# Altium schematic sheet MCU.SchDoc
size A4
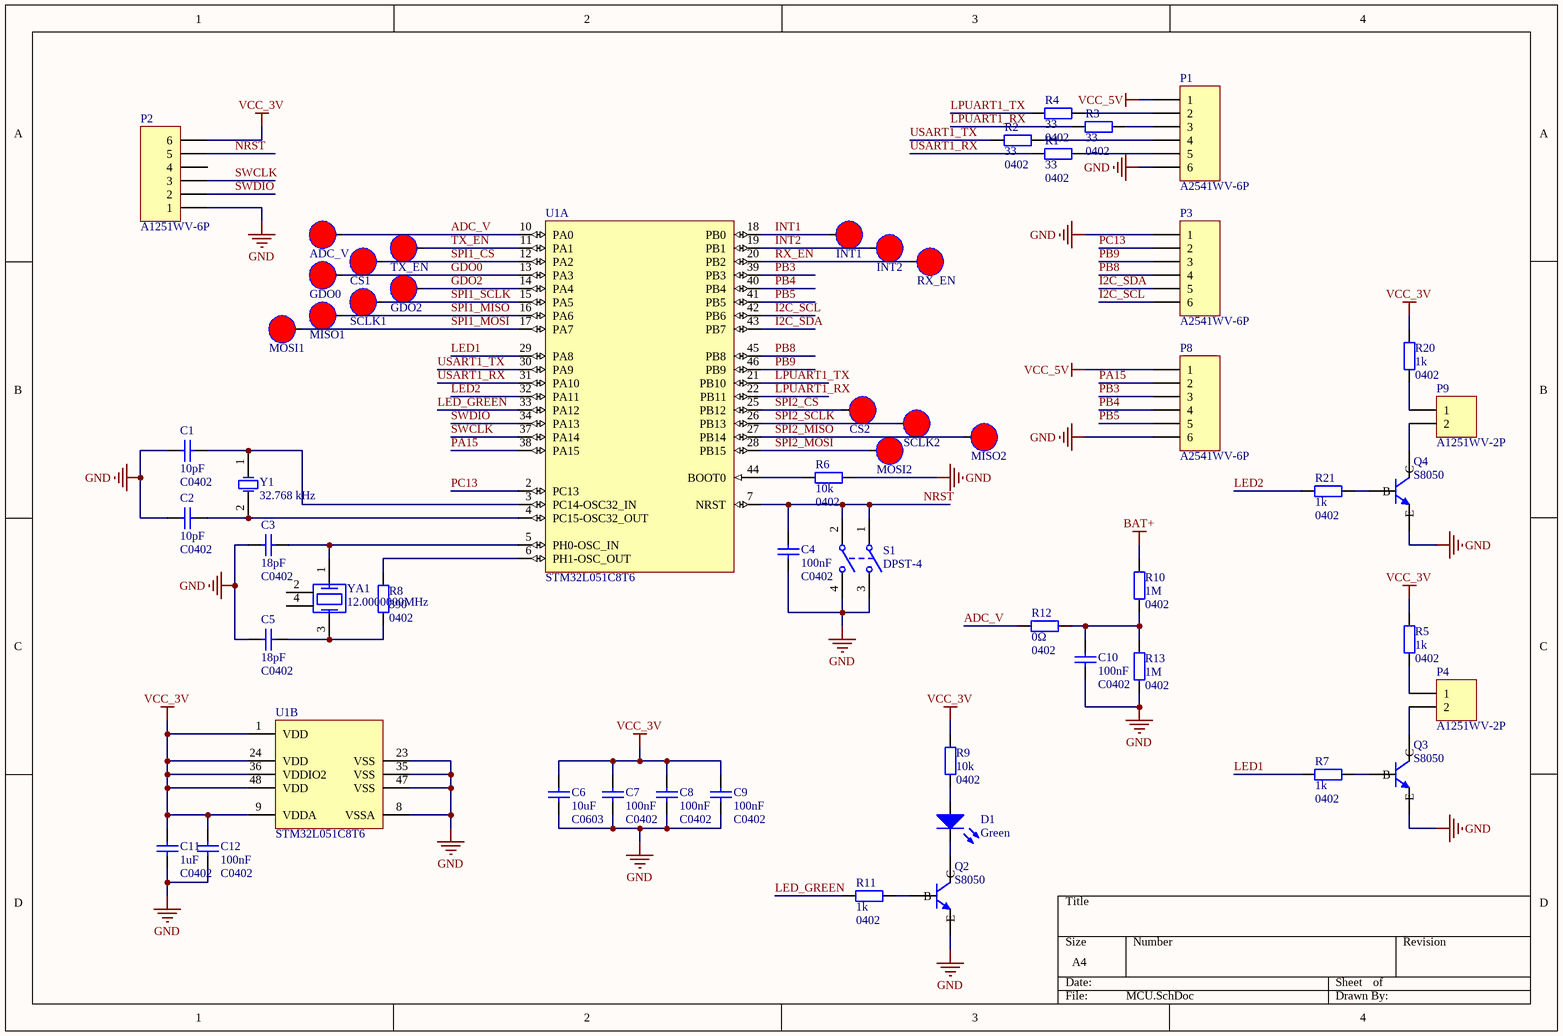
[diagram p0: MCU.SchDoc]

## Parts
ADC_V  TP-EMB-SMT-Single-20mil-1pin  [EMB-SMT-40MILX40MIL]  (value not drawn)
C1  10pF  PackageReference: C0402  [0402]
C2  10pF  PackageReference: C0402  [0402]
C3  18pF  PackageReference: C0402  [0402]
C4  100nF  PackageReference: C0402  [0402]
C5  18pF  PackageReference: C0402  [0402]
C6  10uF  PackageReference: C0603  [1608[0603]]
C7  100nF  PackageReference: C0402  [0402]
C8  100nF  PackageReference: C0402  [0402]
C9  100nF  PackageReference: C0402  [0402]
C10  100nF  PackageReference: C0402  [0402]
C11  1uF  PackageReference: C0402  [0402]
C12  100nF  PackageReference: C0402  [0402]
CS1  TP-EMB-SMT-Single-20mil-1pin  [EMB-SMT-40MILX40MIL]  (value not drawn)
CS2  TP-EMB-SMT-Single-20mil-1pin  [EMB-SMT-40MILX40MIL]  (value not drawn)
D1  Green  [0603/K]
GDO0  TP-EMB-SMT-Single-20mil-1pin  [EMB-SMT-40MILX40MIL]  (value not drawn)
GDO2  TP-EMB-SMT-Single-20mil-1pin  [EMB-SMT-40MILX40MIL]  (value not drawn)
INT1  TP-EMB-SMT-Single-20mil-1pin  [EMB-SMT-40MILX40MIL]  (value not drawn)
INT2  TP-EMB-SMT-Single-20mil-1pin  [EMB-SMT-40MILX40MIL]  (value not drawn)
MISO1  TP-EMB-SMT-Single-20mil-1pin  [EMB-SMT-40MILX40MIL]  (value not drawn)
MISO2  TP-EMB-SMT-Single-20mil-1pin  [EMB-SMT-40MILX40MIL]  (value not drawn)
MOSI1  TP-EMB-SMT-Single-20mil-1pin  [EMB-SMT-40MILX40MIL]  (value not drawn)
MOSI2  TP-EMB-SMT-Single-20mil-1pin  [EMB-SMT-40MILX40MIL]  (value not drawn)
P1  A2541WV-6P  [A2541WV-6P]
P2  A1251WV-6P  [A1251WV-6P-SWD]
P3  A2541WV-6P  [A2541WV-6P]
P4  A1251WV-2P  [A1251WV-2P]
P8  A2541WV-6P  [A2541WV-6P]
P9  A1251WV-2P  [A1251WV-2P]
Q2  S8050  [SOT-23B_N]
Q3  S8050  [SOT-23B_N]
Q4  S8050  [SOT-23B_N]
R1  33  PackageReference: 0402  [RESC1005X04N]
R2  33  PackageReference: 0402  [RESC1005X04N]
R3  33  PackageReference: 0402  [RESC1005X04N]
R4  33  PackageReference: 0402  [RESC1005X04N]
R5  1k  PackageReference: 0402  [RESC1005X04N]
R6  10k  PackageReference: 0402  [RESC1005X04N]
R7  1k  PackageReference: 0402  [RESC1005X04N]
R8  390  PackageReference: 0402  [RESC1005X04N]
R9  10k  PackageReference: 0402  [RESC1005X04N]
R10  1M  PackageReference: 0402  [RESC1005X04N]
R11  1k  PackageReference: 0402  [RESC1005X04N]
R12  0Ω  PackageReference: 0402  [RESC1005X04N]
R13  1M  PackageReference: 0402  [RESC1005X04N]
R20  1k  PackageReference: 0402  [RESC1005X04N]
R21  1k  PackageReference: 0402  [RESC1005X04N]
RX_EN  TP-EMB-SMT-Single-20mil-1pin  [EMB-SMT-40MILX40MIL]  (value not drawn)
S1  DPST-4  [DPST]
SCLK1  TP-EMB-SMT-Single-20mil-1pin  [EMB-SMT-40MILX40MIL]  (value not drawn)
SCLK2  TP-EMB-SMT-Single-20mil-1pin  [EMB-SMT-40MILX40MIL]  (value not drawn)
TX_EN  TP-EMB-SMT-Single-20mil-1pin  [EMB-SMT-40MILX40MIL]  (value not drawn)
U1  STM32L051C8T6  [STM-LQFP48_N]  (parts A,B of 2)
Y1  32.768 kHz  [XTAL-2012]
YA1  12.0000000MHz  [XTAL-SMT-4P]

## Nets
BAT+: R10.2
GND: C1.1 C2.1 C3.1 C4.1 C5.1 C6.1 C7.1 C8.1 C9.1 C10.1 C11.1 C12.1 P1.6 P2.1 P3.1 P8.6 Q2.E Q3.E Q4.E R6.2 R13.1 S1.3(NO1) S1.4(NO2) U1.8(VSSA) U1.23(VSS) U1.35(VSS) U1.47(VSS)
VCC_3V: C6.2 C7.2 C8.2 C9.2 C11.2 C12.2 P2.6 R5.2 R9.2 R20.2 U1.1(VDD) U1.9(VDDA) U1.24(VDD) U1.36(VDDIO2) U1.48(VDD)
VCC_5V: P1.1 P8.1
ADC_V: ADC_V.1 R12.1 U1.10(PA0)
GDO0: GDO0.1 U1.13(PA3)
GDO2: GDO2.1 U1.14(PA4)
I2C_SCL: P3.6 U1.42(PB6)
I2C_SDA: P3.5 U1.43(PB7)
INT1: INT1.1 U1.18(PB0)
INT2: INT2.1 U1.19(PB1)
LED1: R7.1 U1.29(PA8)
LED2: R21.1 U1.32(PA11)
LED_GREEN: R11.1 U1.33(PA12)
LPUART1_RX: R3.1 U1.22(PB11)
LPUART1_TX: R4.1 U1.21(PB10)
NRST: C4.2 P2.5 S1.1(COMMON1) S1.2(COMMON2) U1.7(NRST)
PA15: P8.2 U1.38(PA15)
PB3: P8.3 U1.39(PB3)
PB4: P8.4 U1.40(PB4)
PB5: P8.5 U1.41(PB5)
PB8: P3.4 U1.45(PB8)
PB9: P3.3 U1.46(PB9)
PC13: P3.2 U1.2(PC13)
RX_EN: RX_EN.1 U1.20(PB2)
SPI1_CS: CS1.1 U1.12(PA2)
SPI1_MISO: MISO1.1 U1.16(PA6)
SPI1_MOSI: MOSI1.1 U1.17(PA7)
SPI1_SCLK: SCLK1.1 U1.15(PA5)
SPI2_CS: CS2.1 U1.25(PB12)
SPI2_MISO: MISO2.1 U1.27(PB14)
SPI2_MOSI: MOSI2.1 U1.28(PB15)
SPI2_SCLK: SCLK2.1 U1.26(PB13)
SWCLK: P2.3 U1.37(PA14)
SWDIO: P2.2 U1.34(PA13)
TX_EN: TX_EN.1 U1.11(PA1)
USART1_RX: R1.1 U1.31(PA10)
USART1_TX: R2.2 U1.30(PA9)
NetC1_2: C1.2 U1.3(PC14-OSC32_IN) Y1.1(OSC1)
NetC2_2: C2.2 U1.4(PC15-OSC32_OUT) Y1.2(OSC2)
NetC3_2: C3.2 U1.5(PH0-OSC_IN) YA1.1
NetC5_2: C5.2 R8.1 YA1.3
NetC10_2: C10.2 R10.1 R12.2 R13.2
NetD1_A: D1.A R9.1
NetD1_K: D1.K Q2.C
NetP1_2: P1.2 R4.2
NetP1_3: P1.3 R3.2
NetP1_4: P1.4 R2.1
NetP1_5: P1.5 R1.2
NetP4_1: P4.1 R5.1
NetP4_2: P4.2 Q3.C
NetP9_1: P9.1 R20.1
NetP9_2: P9.2 Q4.C
NetQ2_B: Q2.B R11.2
NetQ3_B: Q3.B R7.2
NetQ4_B: Q4.B R21.2
NetR6_1: R6.1 U1.44(BOOT0)
NetR8_2: R8.2 U1.6(PH1-OSC_OUT)

Not connected (* = marked no-connect by the designer): P2 4; YA1 2 4

## Library data of the parts
ADC_V CS1 CS2 GDO0 GDO2 INT1 INT2 MISO1 MISO2 MOSI1 MOSI2 RX_EN SCLK1 SCLK2 TX_EN = TP-EMB-SMT-Single-20mil-1pin: Test Point Designed for holding a standard probe lead
C1 C2 = CC0402FRNPO9BN100: Capacitor (0402,NPO,10pF,DC 50V,±1%) YAGEO; Published: 8-Jun-2000; LatestRevisionDate: 29-May-2009; LatestRevisionNote: IPC-7351 Footprint Added.; Publisher: Altium Limited; PackageDescription: Chip Capacitor; Value: 10pF
C3 C5 = CC0402FRNPO9BN180: Capacitor (0402,NPO,18pF,DC 50V,±1%) YAGEO; Published: 8-Jun-2000; LatestRevisionDate: 29-May-2009; LatestRevisionNote: IPC-7351 Footprint Added.; Publisher: Altium Limited; PackageDescription: Chip Capacitor; Value: 18pF
C4 C7-C10 C12 = GRM155R71H104KE14: Capacitor (0402,X7R,100nF,DC 50V,±10%) Murata; Published: 8-Jun-2000; LatestRevisionDate: 29-May-2009; LatestRevisionNote: IPC-7351 Footprint Added.; Publisher: Altium Limited; PackageDescription: Chip Capacitor; Value: 100nF
C6 = GRM188R61E106MA73: Capacitor(0603,X5R(EIA),10uF,DC 25V,+/-20 %) muRata; Published: 8-Jun-2000; LatestRevisionDate: 29-May-2009; LatestRevisionNote: IPC-7351 Footprint Added.; Publisher: Altium Limited; PackageDescription: Chip Capacitor; Value: 10uF
C11 = GRM155R61E105KE11: Capacitor (0402,X5R,1uF,DC 25V,±10%) Murata; Published: 8-Jun-2000; LatestRevisionDate: 29-May-2009; LatestRevisionNote: IPC-7351 Footprint Added.; Publisher: Altium Limited; PackageDescription: Chip Capacitor; Value: 1uF
D1 = XL-1608SYGC: Standard 0603 SMD LED, Green, 1.6-2.2V; Published: 8-Jun-2000; LatestRevisionDate: 17-Jul-2002; LatestRevisionNote: Re-released for DXP Platform.; PackageVersion: Feb-2002; PackageReference: 0603; Publisher: Altium Limited; PackageDescription: SM LED; 2 Flat Leads; Valid: Green
P1 P3 P8 = A2541WV-6P: Header, 6-Pin, 针座-2.54mm间距，180度，DIP排针; LatestRevisionDate: 17-Jul-2002; LatestRevisionNote: Re-released for DXP Platform.; Publisher: Altium Limited
P2 = A1251WV-6P: Header, 6-Pin, 1.25mm PITCH, 180° WAFER; LatestRevisionDate: 17-Jul-2002; LatestRevisionNote: Re-released for DXP Platform.; Publisher: Altium Limited
P4 P9 = A1251WV-2P: Header, 2-Pin, 1.25mm PITCH, 180° WAFER; LatestRevisionDate: 17-Jul-2002; LatestRevisionNote: Re-released for DXP Platform.; Publisher: Altium Limited
Q2-Q4 = S8050: NPN General Purpose Amplifier, -55 to +150°C; Manufacturer: 扬州扬杰电子科技股份有限公司; VCBO(V): 40; VCEO(V): 25; VEBO(V): 5; IC(mA): 500; PC(mW): 300; Package: SOT-23
R1-R4 = RC0402FR-0733RL: Resistor 0402(1005) 33Ω ±1%; PackageDescription: Chip Resistor, 2-Leads, Body 1.00x0.50mm, IPC Medium Density; Value: 33
R5 R7 R11 R20 R21 = RC0402FR-071KL: Resistor 0402(1005) 1kΩ ±1%; PackageDescription: Chip Resistor, 2-Leads, Body 1.00x0.50mm, IPC Medium Density; Value: 1k
R6 R9 = RC0402FR-0710KL: Resistor 0402(1005) 10kΩ ±1%; PackageDescription: Chip Resistor, 2-Leads, Body 1.00x0.50mm, IPC Medium Density; Value: 10k
R8 = RC0402FR-07390RL: Resistor 0402(1005) 390Ω ±1%; PackageDescription: Chip Resistor, 2-Leads, Body 1.00x0.50mm, IPC Medium Density; Value: 390
R10 R13 = RC0402FR-071ML: Resistor 0402(1005) 1MΩ ±1%; PackageDescription: Chip Resistor, 2-Leads, Body 1.00x0.50mm, IPC Medium Density; Value: 1M
R12 = RC0402JR: Resistor 0402(1005) 0Ω; PackageDescription: Chip Resistor, 2-Leads, Body 1.00x0.50mm, IPC Medium Density; Value: 0Ω
S1 = CX-G001: 5.2*5.2轻触开关; Published: 24-Mar-1999; LatestRevisionDate: 17-Jul-2002; LatestRevisionNote: Re-released for DXP Platform.; PackageReference: DPST-4; Publisher: Altium Limited; PackageDescription: Switch; 4 Leads
U1 = STM32L051C8T6: Access line ultra-low-power 32-bit MCU Arm®-based Cortex®-M0+, 64 KB Flash, 8 KB SRAM,2 KB EEPROM, 38 fast I/Os, 48-pin LQFP, -40 to 125 degC, Tray; A/D Converter: 2x12-bit; Core: ARM Cortex-M0+; FLASH Size (Prog) (kB): 64; I/Os (High Current): 37; Internal RAM Size (kB): 20; Operating Frequency(F) (Processor speed) (MHz): 32; Supply Voltage(Vcc) min (V): 2; DatasheetVersion: Rev. 16; PackageVersion: Rev. 6, 06/2013; PackageReference: LQFP48; PackageDescription: 48-Pin Low Profile Quad Flat Package, 7 x 7 mm Body, 0.5 mm Pitch; Supplier 1: Digi-Key; Supplier Part Number 1: 497-11517-ND; Supplier 2: Farnell; Supplier Part Number 2: 1899017; Supplier 3: Newark; Supplier Part Number 3: 72T2644; Supplier 4: Mouser; Supplier Part Number 4: 511-STM32L051C8T6; Packing: Tray; Mounting Technology: Surface Mount; PartNumber: STM32L051C8T6; ComponentLink1Description: Manufacturer URL; ComponentLink1URL: http://www.st.com/web/en/home.html; ComponentLink2Description: Datasheet; ComponentLink2URL: http://www.st.com/st-web-ui/static/active/en/resource/technical/document/datasheet/CD00161566.pdf; ComponentLink3Description: Package Specification; ComponentLink3URL: http://www.st.com/st-web-ui/static/active/en/resource/technical/document/datasheet/DM00058181.pdf
Y1 = 7RC32768F12UC: Crystal Oscillator, 2.0×1.2×0.6 mm, 2 Pins, 32.768kHz, -40°C~+85°C, 12pF; Manufacturer: SJK; Package size (L×W×H): 2.0×1.2×0.60 mm; Frequency Tolerance: ±5ppm, ±10ppm, ±20ppm (max.) at 25°C; Frequency range: 32.768 kHz; Operating Temperature Range: Re-released for DXP Platform.; PackageReference: -40°C~+85°C; Load Capacitance: 12pF
YA1 = 7U12000E12UCG: Crystal Oscillator, 3.2×2.5×0.70 mm, 4 Pins, 12.000MHz, -40°C~+85°C, 12pF, ±10PPM; Manufacturer: SJK; Mode: AT/Fundamental; Frequency Tolerance: ±10ppm max; Load Capacitance(CL): 12.0pF; Shunt Capacitance: 3.0 pF Max; Frequency Range: 12.0000000MHz; Operating Temperature Range: -40 °C to +85°C; Package size (L×W×H): 3.2×2.5×0.70 mm